# EasyEDA schematic SCH.json
TITLE: Sheet_1; REV: 1.0; Date: 2023-02-23; Sheet: 1/1; Drawn By: maggie.j.liu; Company: Your Company
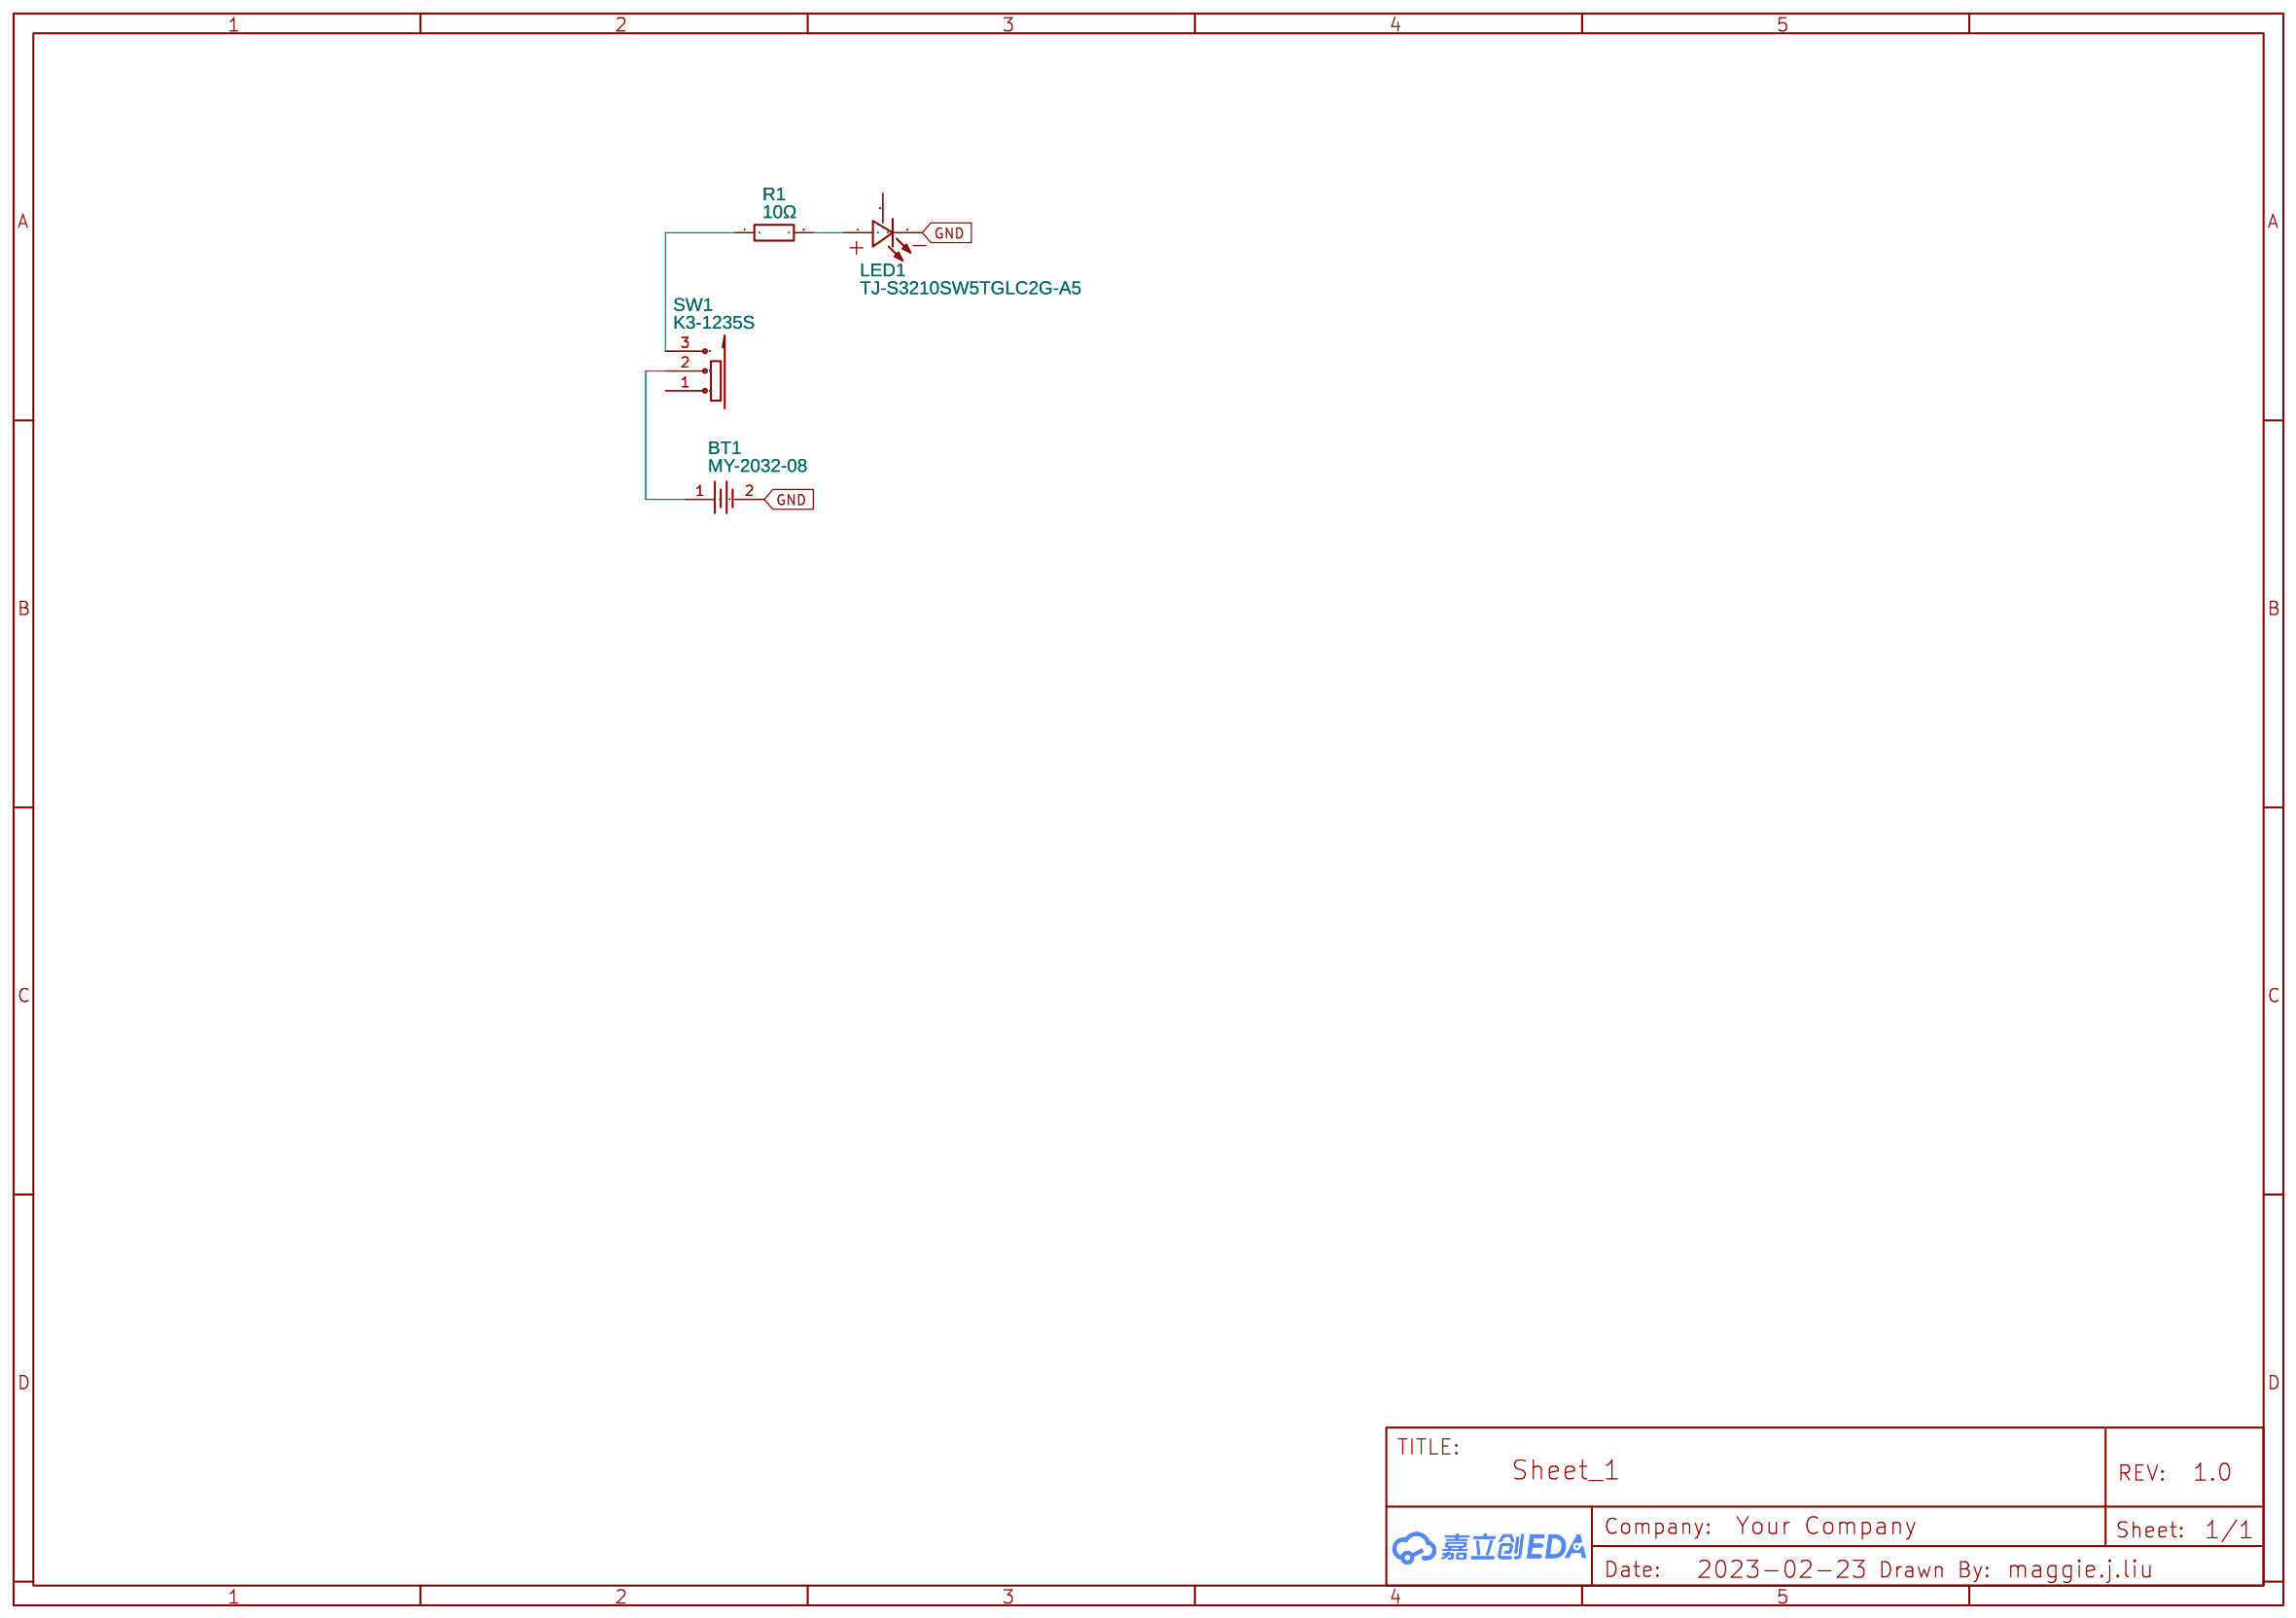
[diagram p0: schematic sheet]

## Parts
BT1  MY-2032-08  [BAT-SMD_MY-2032-08]
LED1  TJ-S3210SW5TGLC2G-A5  [LED-SMD_3P-L3.2-W1.0-RD]
R1  10Ω  [R0603]
SW1  K3-1235S  [SW-SMD_K3-1235S-K1]

## Library data of the parts
BT1 = MY-2032-08: Supplier: LCSC; Supplier Part: C964831; Manufacturer: MYOUNG(美阳); Contributor: LCSC; JLCPCB Part Class: Extended Part
LED1 = TJ-S3210SW5TGLC2G-A5: Supplier: LCSC; Supplier Part: C273630; Manufacturer: TOGIALED(统佳); Contributor: LCSC; JLCPCB Part Class: Extended Part
R1 = 0603WAF100JT5E: Supplier: LCSC; Manufacturer: UNI-ROYAL(厚声); Supplier Part: C22859; JLCPCB Part Class: Basic Part
SW1 = K3-1235S: Supplier: LCSC; Manufacturer: 韩国韩荣; Manufacturer Part: K3-1235S-F1; Supplier Part: C92660; JLCPCB Part Class: Extended Part

## Nets
GND: BT1.2 LED1.1
Net-(BT1-1): BT1.1 SW1.2
Net-(LED1-2): LED1.2 R1.2
Net-(R1-1): R1.1 SW1.3

Not connected (* = marked no-connect by the designer): LED1 3; SW1 1
